# EAGLE schematic Apo Board 2017_PM (EAGLE 7.7.0)
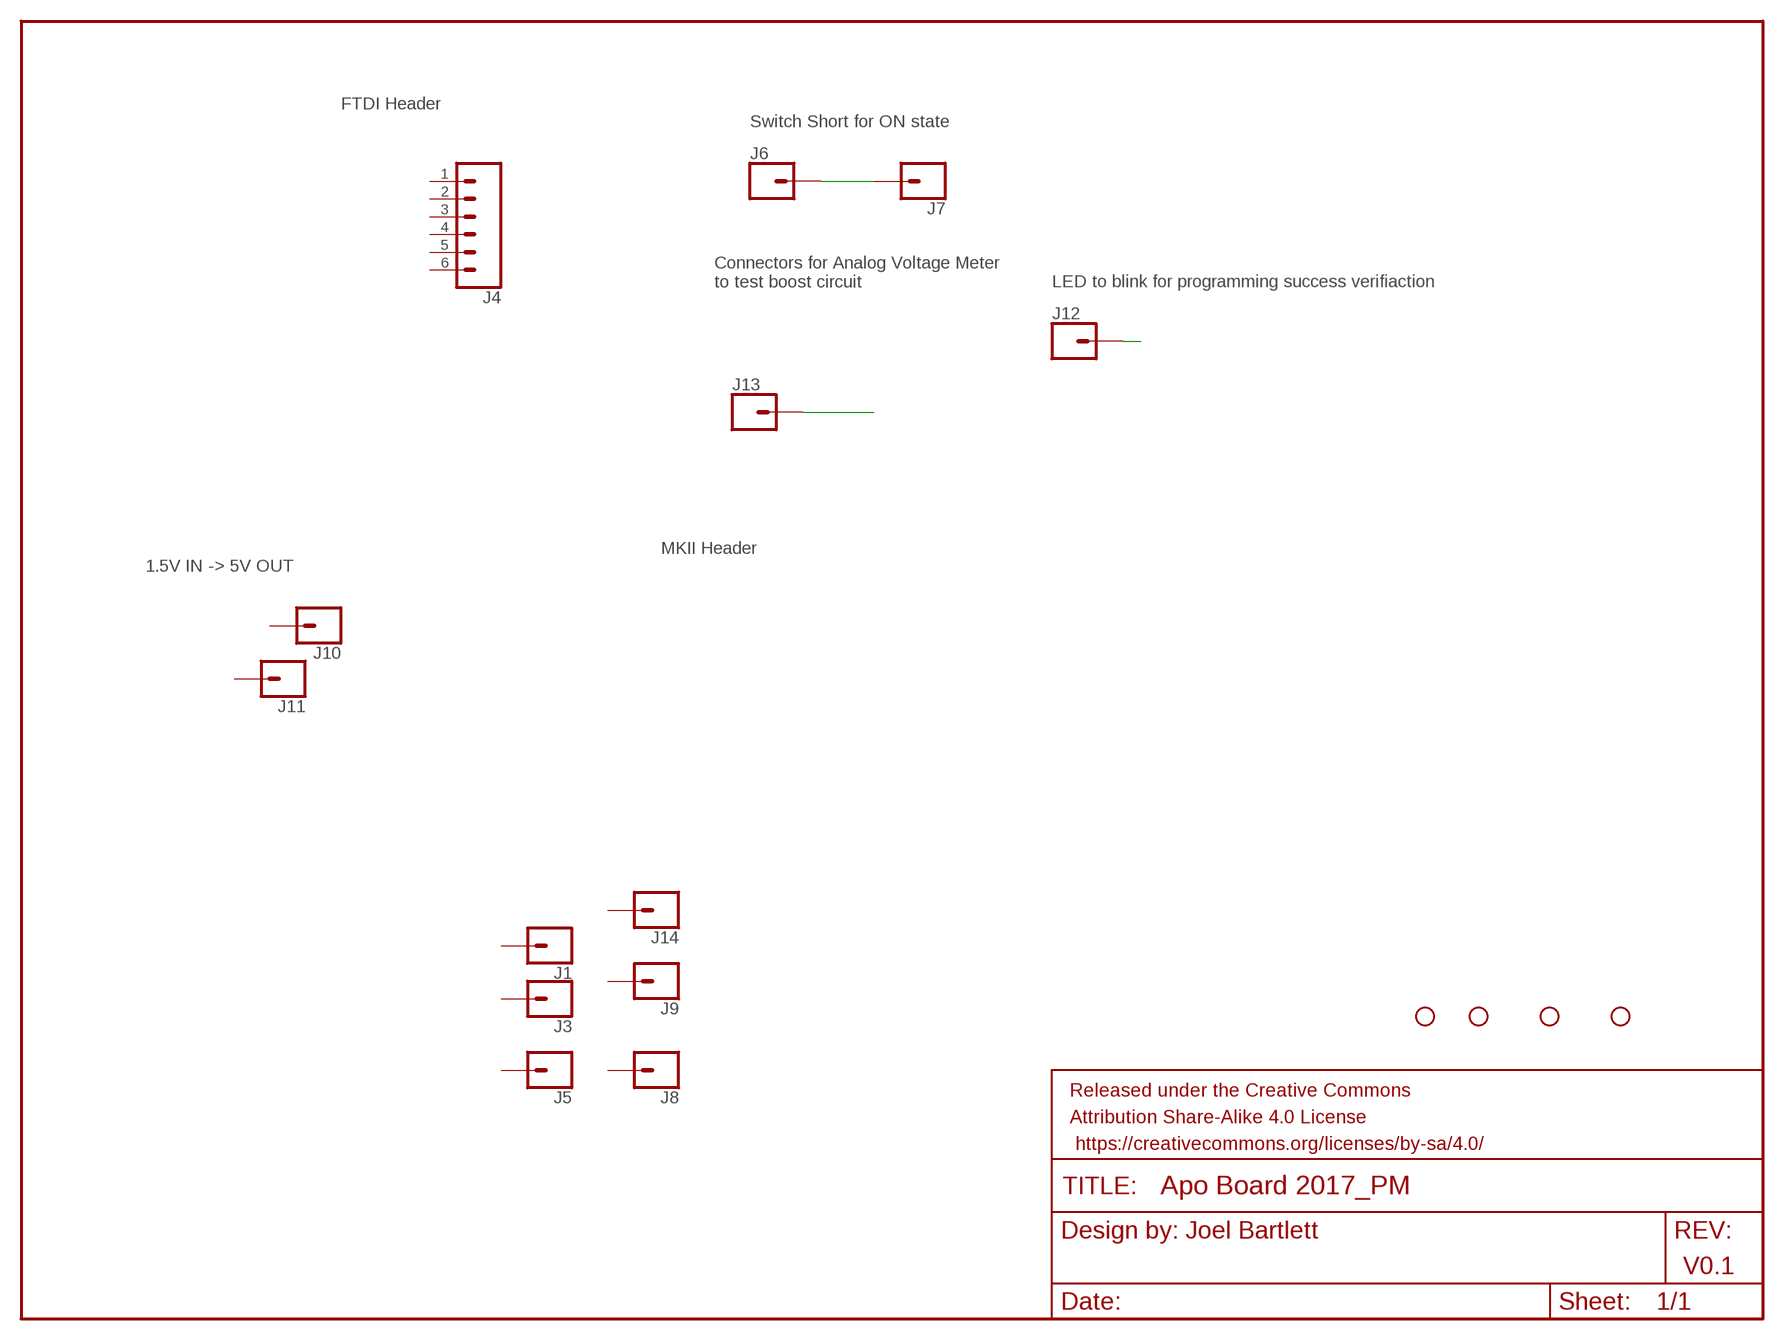
[diagram p0: schematic, sheet 1]

## Parts
FRAME1  FRAME-LETTER  [CREATIVE_COMMONS]
H2  STAND-OFF  [STAND-OFF]
H3  STAND-OFF  [STAND-OFF]
H4  STAND-OFF  [STAND-OFF]
H5  STAND-OFF  [STAND-OFF]
J1  CONN_01POGOPIN_HOLE_0.58  [1X01_POGOPIN_HOLE_0.58_DIA]
J3  CONN_01POGOPIN_HOLE_0.58  [1X01_POGOPIN_HOLE_0.58_DIA]
J4  CONN_06POGOPIN_HOLES_ONLY  [1X06_HOLES_ONLY]
J5  CONN_01POGOPIN_HOLE_0.58  [1X01_POGOPIN_HOLE_0.58_DIA]
J6  CONN_01POGOPIN_HOLE_0.58  [1X01_POGOPIN_HOLE_0.58_DIA]
J7  CONN_01POGOPIN_HOLE_0.58  [1X01_POGOPIN_HOLE_0.58_DIA]
J8  CONN_01POGOPIN_HOLE_0.58  [1X01_POGOPIN_HOLE_0.58_DIA]
J9  CONN_01POGOPIN_HOLE_0.58  [1X01_POGOPIN_HOLE_0.58_DIA]
J10  CONN_01POGOPIN_HOLE_0.58  [1X01_POGOPIN_HOLE_0.58_DIA]
J11  CONN_01POGOPIN_HOLE_0.58  [1X01_POGOPIN_HOLE_0.58_DIA]
J12  CONN_01POGOPIN_HOLE_0.58  [1X01_POGOPIN_HOLE_0.58_DIA]
J13  CONN_01POGOPIN_HOLE_0.58  [1X01_POGOPIN_HOLE_0.58_DIA]
J14  CONN_01POGOPIN_HOLE_0.58  [1X01_POGOPIN_HOLE_0.58_DIA]

## Nets
N$13: J6.1 J7.1
N$15: J12.1
N$17: J13.1
Unconnected: J1.1 J3.1 J4.1 J4.2 J4.3 J4.4 J4.5 J4.6 J5.1 J8.1 J9.1 J10.1 J11.1 J14.1

## Notes on the sheet
- FTDI Header
- Switch Short for ON state
- Connectors for Analog Voltage Meter
  to test boost circuit
- LED to blink for programming success verifiaction
- MKII Header
- 1.5V IN -> 5V OUT
- Joel Bartlett
- V0.1

## Library data of the parts
FRAME1 = SparkFun-Aesthetics:FRAME-LETTER: Schematic Frame - Letter Standard 8.5x11 US Letter frame
H2-H5 = SparkFun-Hardware:STAND-OFF: Stand Off Drill holes for mechanically mounting via screws, standoffs, etc. Note: Use the keepout ring to avoid running the screw head into surrounding components. Variant Overviews STAND-OFF - Mechanical footprint for a #4 phillips button head screw. STAND-OFF-TIGHT - Mechanical footprint for a #4 phillips button head screw, Example SparkFun Products Screw - Phillips Head (1/4", 4-40, 10 pack) <https://www.sparkfun.com/products/10453> (PRT-10453) Screw - Phillips Head (1/2", 4-40, 10 pack) <https://www.sparkfun.com/products/10452> (PRT-10452) Screw - Phillips Head (3/4", 4-40, 10 pack) <https://www.sparkfun.com/products/10451> (PRT-10451) Screw - Phillips Head (1", 4-40, 10 pack) <https://www.sparkfun.com/products/10450> (PRT-10450)
J1 J3 J5-J14 = SparkFun-Connectors:CONN_01: Single connection point. Often used as Generic Header-pin footprint for 0.1 inch spaced/style header connections On any of the 0.1 inch spaced packages, you can populate with these: Break Away Headers - Straight <https://www.sparkfun.com/products/116> (PRT-00116) Break Away Male Headers - Right Angle <https://www.sparkfun.com/products/553> (PRT-00553) Female Headers <https://www.sparkfun.com/products/115> (PRT-00115) Break Away Headers - Machine Pin <https://www.sparkfun.com/products/117> (PRT-00117) Break Away Female Headers - Swiss Machine Pin <https://www.sparkfun.com/products/743> (PRT-00743) This device is also useful as a general connection point to wire up your design to another part of your project. Our various solder wires solder well into these plated through hole pads. Hook-Up Wire - Assortment (Stranded, 22 AWG) <https://www.sparkfun.com/products/11375> (PRT-11375) Hook-Up Wire - Assortment (Solid Core, 22 AWG) <https://www.sparkfun.com/products/11367> (PRT-11367) View the entire wire category on our website here <https://www.sparkfun.com/categories/141> Special notes: SMTSO-256-ET is a "flush mount" nut for a 4-40 screw. We mostly use this on specialty testbeds; it is a nice way to connect hardware to your PCB at an adjustable hieght. Also note, the SNAP packages are for using a snappable style connector. We sell a baggie of snaps and they are also used on two LilyPad designs: Snap Assortment - 30 pack (male and female) <https://www.sparkfun.com/products/11347> (DEV-11347) LilyPad Arduino SimpleSnap <https://www.sparkfun.com/products/10941> (DEV-10941) LilyPad SimpleSnap Protoboard <https://www.sparkfun.com/products/10940> (DEV-10940)
J4 = SparkFun-Connectors:CONN_06: Multi connection point. Often used as Generic Header-pin footprint for 0.1 inch spaced/style header connections On any of the 0.1 inch spaced packages, you can populate with these: Break Away Headers - Straight <https://www.sparkfun.com/products/116> (PRT-00116) Break Away Male Headers - Right Angle <https://www.sparkfun.com/products/553> (PRT-00553) Female Headers <https://www.sparkfun.com/products/115> (PRT-00115) Break Away Headers - Machine Pin <https://www.sparkfun.com/products/117> (PRT-00117) Break Away Female Headers - Swiss Machine Pin <https://www.sparkfun.com/products/743> (PRT-00743) Arduino Stackable Header - 6 Pin <https://www.sparkfun.com/products/9280> (PRT-09280) For SCREWTERMINALS and SPRING TERMINALS visit here: Screw Terimnals on SparkFun.com <https://www.sparkfun.com/search/results?term=Screw+Terminals> (5mm/3.5mm/2.54mm spacing) This device is also useful as a general connection point to wire up your design to another part of your project. Our various solder wires solder well into these plated through hole pads. Hook-Up Wire - Assortment (Stranded, 22 AWG) <https://www.sparkfun.com/products/11375> (PRT-11375) Hook-Up Wire - Assortment (Solid Core, 22 AWG) <https://www.sparkfun.com/products/11367> (PRT-11367) View the entire wire category on our website here <https://www.sparkfun.com/categories/141>; PROD_ID: CONN-08437

## Net classes
0 default: width 0.152 mm, drill 0.305 mm, clearance 0.152 mm
1 vcc: width 0.254 mm
3 ButtonSignal: width 0.254 mm